# Altium schematic sheet POWER.SchDoc
size A4
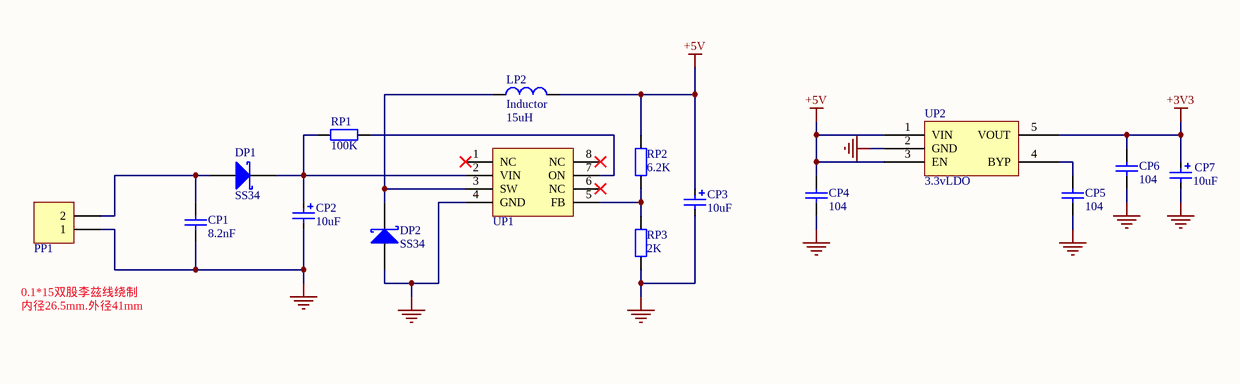
[diagram p0: POWER.SchDoc]

## Parts
CP1  value 8.2nF  [CAPC2012N]  (hidden comment: Cap1)
CP2  value 10uF  [CAP_TAN_B1210]  (hidden comment: Cap_Tan)
CP3  value 10uF  [CAP_TAN_B1210]  (hidden comment: Cap_Tan)
CP4  value 104  [CAPC1608N]  (hidden comment: Cap1)
CP5  value 104  [CAPC1608N]  (hidden comment: Cap1)
CP6  value 104  [CAPC1608N]  (hidden comment: Cap1)
CP7  value 10uF  [CAP_TAN_P0805]  (hidden comment: Cap_Tan)
DP1  SS34  [DO-214AC]
DP2  SS34  [DO-214AC]
LP2  Inductor  value 15uH  [IND_7032]
PP1  Header 2  [HDR1X2]  (value not drawn)
RP1  value 100K  [RESC1608N]  (hidden comment: Res1)
RP2  value 6.2K  [RESC1608N]  (hidden comment: Res1)
RP3  value 2K  [RESC1608N]  (hidden comment: Res1)
UP1  XKT-3168  [SOP8_L]  (value not drawn)
UP2  3.3vLDO  [SOT23-5_L]

## Nets
+3V3: CP6.2 CP7.1 UP2.5(VOUT)
+5V: CP3.1 CP4.2 LP2.2 RP2.2 UP2.1(VIN) UP2.3(EN)
GND: CP1.1 CP2.2 CP3.2 CP4.1 CP5.1 CP6.1 CP7.2 DP2.1(A) PP1.1 RP3.1 UP1.4(GND) UP2.2(GND)
NetCP1_2: CP1.2 DP1.1(A) PP1.2
NetCP2_1: CP2.1 DP1.2(K) RP1.1 UP1.2(VIN)
NetCP5_2: CP5.2 UP2.4(BYP)
NetDP2_2: DP2.2(K) LP2.1 UP1.3(SW)
NetRP1_2: RP1.2 UP1.7(ON)
NetRP2_1: RP2.1 RP3.2 UP1.5(FB)

Not connected (* = marked no-connect by the designer): UP1 1(NC)* 6(NC)* 8(NC)*

## Notes on the sheet
- 0.1*15双股李兹线绕制
  内径26.5mm.外径41mm

## Library data of the parts
CP1 CP4-CP6 = Cap1: Capacitor; Published: 8-Jun-2000; LatestRevisionDate: 17-Jul-2002; LatestRevisionNote: Re-released for DXP Platform.; PackageReference: RAD-0.3; Publisher: Altium Limited
CP2 CP3 CP7 = Cap_Tan: Capacitor
DP1 DP2 = D Schottky: Schottky Diode; Published: 8-Jun-2000; LatestRevisionDate: 17-Jul-2002; LatestRevisionNote: Re-released for DXP Platform.; PackageReference: SMB; Publisher: Altium Limited; Code_JEDEC: DO-214-AA
LP2 = Inductor: Code_IEC: 1005; Published: 8-Jun-2000; LatestRevisionDate: 29-May-2009; LatestRevisionNote: IPC-7351 Footprint Added.; PackageReference: 0402-A; Publisher: Altium Limited; PackageDescription: Chip Inductor; Code_JEITA: 0402
PP1 = Header 2: Header, 2-Pin; LatestRevisionDate: 17-Jul-2002; LatestRevisionNote: Re-released for DXP Platform.; Publisher: Altium Limited
RP1-RP3 = Res1: Resistor; Published: 8-Jun-2000; LatestRevisionDate: 17-Jul-2002; LatestRevisionNote: Re-released for DXP Platform.; PackageReference: AXIAL-0.4; Publisher: Altium Limited
UP2 = LDO-SOT23-5